# EAGLE schematic Coil (EAGLE 9.2.0)
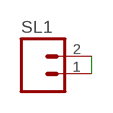
[diagram p0: schematic, sheet 1]

## Parts
SL1  M02  [02P]

## Nets
N$3: SL1.1 SL1.2

## Library data of the parts
SL1 = CEDT_JANUARY_2015_v5:M02: AMP QUICK CONNECTOR